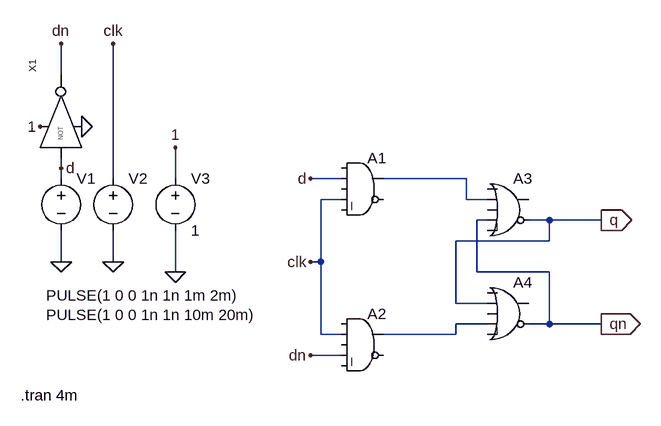
[diagram p0: schematic Draft36.asc]
Draft36.asc, the LTspice schematic file:
Version 4
SHEET 1 880 680
WIRE -336 -128 -336 -176
WIRE -336 16 -336 0
WIRE -336 32 -336 16
WIRE -256 32 -256 -176
WIRE -160 32 -160 -16
WIRE 96 32 48 32
WIRE 288 32 160 32
WIRE 96 64 64 64
WIRE 288 64 288 32
WIRE 320 64 288 64
WIRE 320 96 304 96
WIRE 416 96 384 96
WIRE 496 96 416 96
WIRE 416 128 416 96
WIRE 416 128 272 128
WIRE -336 160 -336 112
WIRE -256 160 -256 112
WIRE 64 160 64 64
WIRE 64 160 48 160
WIRE -160 176 -160 112
WIRE 304 176 304 96
WIRE 416 176 304 176
WIRE 272 224 272 128
WIRE 320 224 272 224
WIRE 320 256 272 256
WIRE 416 256 416 176
WIRE 416 256 384 256
WIRE 496 256 416 256
WIRE 64 272 64 160
WIRE 96 272 64 272
WIRE 272 272 272 256
WIRE 272 272 160 272
WIRE 96 304 48 304
FLAG -160 -16 1
FLAG -256 -176 clk
FLAG -336 -176 dn
FLAG -336 16 d
FLAG -368 -48 1
FLAG -304 -48 0
FLAG -160 176 0
FLAG -256 160 0
FLAG -336 160 0
FLAG 48 160 clk
FLAG 48 32 d
FLAG 48 304 dn
FLAG 496 96 q
IOPIN 496 96 Out
FLAG 496 256 qn
IOPIN 496 256 Out
SYMBOL Digital\\and 128 -16 R0
SYMATTR InstName A1
SYMBOL Digital\\and 128 224 R0
SYMATTR InstName A2
SYMBOL Digital\\or 352 16 R0
SYMATTR InstName A3
SYMBOL Digital\\or 352 176 R0
SYMATTR InstName A4
SYMBOL voltage -336 16 R0
WINDOW 3 -23 196 Left 2
WINDOW 123 0 0 Left 0
WINDOW 39 0 0 Left 0
SYMATTR InstName V1
SYMATTR Value PULSE(1 0 0 1n 1n 1m 2m)
SYMBOL voltage -256 16 R0
WINDOW 3 -103 226 Left 2
WINDOW 123 0 0 Left 0
WINDOW 39 0 0 Left 0
SYMATTR InstName V2
SYMATTR Value PULSE(1 0 0 1n 1n 10m 20m)
SYMBOL NOT4 -320 -64 R270
SYMATTR InstName X1
SYMBOL voltage -160 16 R0
WINDOW 123 0 0 Left 0
WINDOW 39 0 0 Left 0
SYMATTR InstName V3
SYMATTR Value 1
TEXT -398 366 Left 2 !.tran 4m

The netlist it stands for:
* Draft36.asc
A1 0 d 0 clk 0 0 N001 0 AND
A2 0 clk 0 dn 0 0 N002 0 AND
A3 0 N001 0 qn 0 q 0 0 OR
A4 0 q 0 N002 0 qn 0 0 OR
V1 d 0 PULSE(1 0 0 1n 1n 1m 2m)
V2 clk 0 PULSE(1 0 0 1n 1n 10m 20m)
XX1 d 1 0 dn NOT4  ; pins A VH VL OUT
V3 1 0 1
.tran 4m
.backanno
.end

* Results of the author's LTspice run, read from the files saved beside the schematic
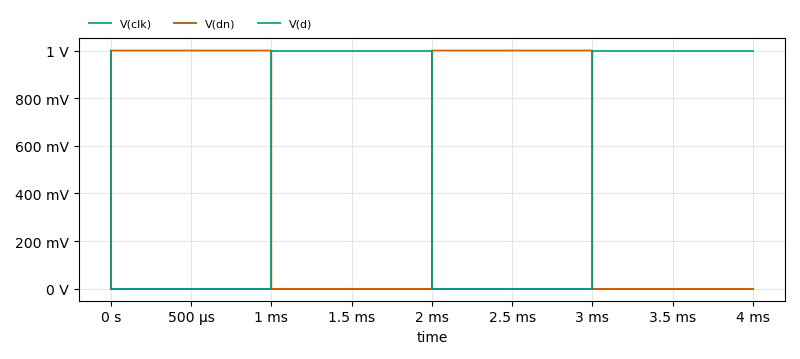
[diagram p1: Transient Analysis of Draft36.asc, plotted from the saved traces]
* Transient Analysis, 1 run:
*   V(clk): min 0 V, max 1 V, average 125 nV, rms 294.7 µV, last 0 V
*   V(dn): min 0 V, max 1.001 V, average 500 mV, rms 707.1 mV, last 100.5 nV
*   V(d): min 0 V, max 1 V, average 500 mV, rms 707.1 mV, last 1 V